# EAGLE design tdoa_4011_decotec (EAGLE 8.2.2)
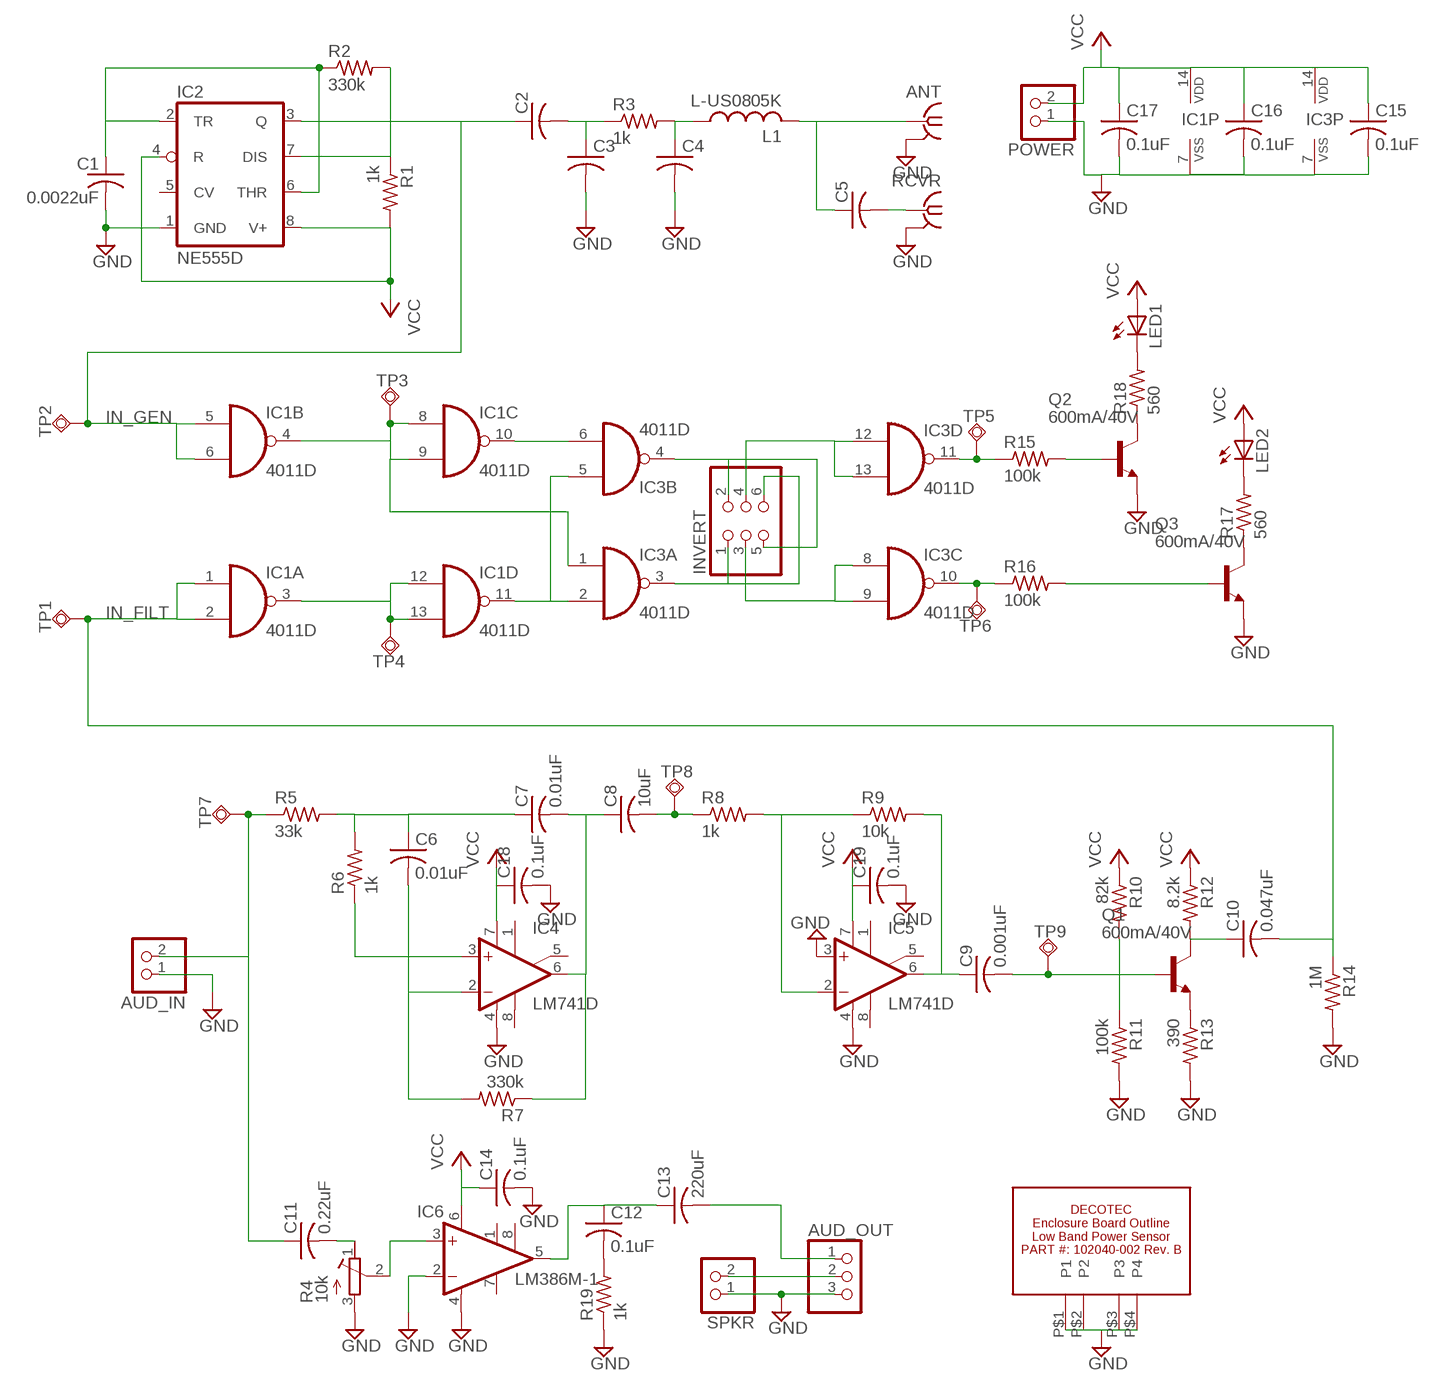
[diagram p0: schematic, sheet 1]

## Parts
ANT  SMA-142-0701-801/806  [J502-ND-142-0701-801/806]
AUD_IN  PINHD-1X2  [1X02]
AUD_OUT  PINHD-1X3  [1X03]
C1  0.0022uF  C-USC0805K  [C0805K]
C2  C-USC0805K  [C0805K]
C3  C-USC0805K  [C0805K]
C4  C-USC0805K  [C0805K]
C5  C-USC0805K  [C0805K]
C6  0.01uF  C-USC0805K  [C0805K]
C7  0.01uF  C-USC0805K  [C0805K]
C8  10uF  C-USC0805K  [C0805K]
C9  0.001uF  C-USC0805K  [C0805K]
C10  0.047uF  C-USC0805K  [C0805K]
C11  0.22uF  C-USC0805K  [C0805K]
C12  0.1uF  C-USC0805K  [C0805K]
C13  220uF  C-USC0805K  [C0805K]
C14  0.1uF  C-USC0805K  [C0805K]
C15  0.1uF  C-USC0805K  [C0805K]
C16  0.1uF  C-USC0805K  [C0805K]
C17  0.1uF  C-USC0805K  [C0805K]
C18  0.1uF  C-USC0805K  [C0805K]
C19  0.1uF  C-USC0805K  [C0805K]
IC1  4011D  [SO14]
IC2  NE555D  [SO08]
IC3  4011D  [SO14]
IC4  LM741D  [SO08]
IC5  LM741D  [SO08]
IC6  LM386M-1  [SO08]
INVERT  PINHD-2X3  [2X03]
L1  L-US0805K  [C0805K]
LED1  LED3MM  [LED3MM]
LED2  LED3MM  [LED3MM]
POWER  PINHD-1X2  [1X02]
Q1  600mA/40V  MMBT3904LT1-NPN-SOT23-BEC  [SOT23-BEC]
Q2  600mA/40V  MMBT3904LT1-NPN-SOT23-BEC  [SOT23-BEC]
Q3  600mA/40V  MMBT3904LT1-NPN-SOT23-BEC  [SOT23-BEC]
R1  1k  R-US_R0805  [R0805]
R2  330k  R-US_R0805  [R0805]
R3  1k  R-US_R0805  [R0805]
R4  10k  R-TRIMM3314G  [RTRIM3314G]
R5  33k  R-US_R0805  [R0805]
R6  1k  R-US_R0805  [R0805]
R7  330k  R-US_R0805  [R0805]
R8  1k  R-US_R0805  [R0805]
R9  10k  R-US_R0805  [R0805]
R10  82k  R-US_R0805  [R0805]
R11  100k  R-US_R0805  [R0805]
R12  8.2k  R-US_R0805  [R0805]
R13  390  R-US_R0805  [R0805]
R14  1M  R-US_R0805  [R0805]
R15  100k  R-US_R0805  [R0805]
R16  100k  R-US_R0805  [R0805]
R17  560  R-US_R0805  [R0805]
R18  560  R-US_R0805  [R0805]
R19  1k  R-US_R0805  [R0805]
RCVR  SMA-142-0701-801/806  [J502-ND-142-0701-801/806]
SPKR  PINHD-1X2  [1X02]
TP1  TPSQTP20SQ  [TP20SQ]
TP2  TPSQTP20SQ  [TP20SQ]
TP3  TPSQTP20SQ  [TP20SQ]
TP4  TPSQTP20SQ  [TP20SQ]
TP5  TPSQTP20SQ  [TP20SQ]
TP6  TPSQTP20SQ  [TP20SQ]
TP7  TPSQTP20SQ  [TP20SQ]
TP8  TPSQTP20SQ  [TP20SQ]
TP9  TPSQTP20SQ  [TP20SQ]
U$1  DECOTEC_102040-002B  [DECOTEC_102040-002B]

## Nets
AUDIO_IN: AUD_IN.2 C11.1 R5.1 TP7.TP
GND: ANT.G@1 ANT.G@2 ANT.G@3 ANT.G@4 AUD_IN.1 AUD_OUT.3 C1.2 C3.2 C4.2 C14.2 C15.2 C16.2 C17.2 C18.2 C19.2 IC1.7(P:VSS) IC2.1(GND) IC3.7(P:VSS) IC4.4(V-) IC5.3(+IN) IC5.4(V-) IC6.2(-IN) IC6.4(GND) POWER.1 Q2.E Q3.E R4.3(A) R11.2 R13.2 R14.2 R19.1 RCVR.G@1 RCVR.G@2 RCVR.G@3 RCVR.G@4 SPKR.1 U$1.P$1(P1) U$1.P$2(P2) U$1.P$3(P3) U$1.P$4(P4)
IN_FILT: C10.2 IC1.1(A:I0) IC1.2(A:I1) R14.1 TP1.TP
IN_GEN: C2.1 IC1.5(B:I0) IC1.6(B:I1) IC2.3(Q) TP2.TP
N$1: IC1.4(B:O) IC1.8(C:I0) IC1.9(C:I1) IC3.1(A:I0) TP3.TP
N$2: IC2.7(DIS) R1.1 R2.2
N$3: C1.1 IC2.2(TR) IC2.6(THR) R2.1
N$4: C2.2 C3.1 R3.1
N$5: C4.1 L1.1 R3.2
N$6: AUD_OUT.1 C13.2
N$7: C5.2 RCVR.1
N$8: ANT.1 C5.1 L1.2
N$10: C6.1 C7.1 R5.2 R6.2
N$11: IC4.3(+IN) R6.1
N$12: C6.2 IC4.2(-IN) R7.2
N$13: C7.2 C8.1 IC4.6(OUT) R7.1
N$14: C8.2 R8.1 TP8.TP
N$15: IC5.2(-IN) R8.2 R9.1
N$16: C9.1 IC5.6(OUT) R9.2
N$17: C9.2 Q1.B R10.2 R11.1 TP9.TP
N$18: Q1.E R13.1
N$19: C10.1 Q1.C R12.2
N$20: IC1.3(A:O) IC1.12(D:I0) IC1.13(D:I1) TP4.TP
N$21: IC1.11(D:O) IC3.2(A:I1) IC3.5(B:I0)
N$22: IC3.4(B:O) INVERT.2 INVERT.5
N$23: IC1.10(C:O) IC3.6(B:I1)
N$24: IC3.3(A:O) INVERT.1 INVERT.6
N$25: IC3.12(D:I0) IC3.13(D:I1) INVERT.4
N$26: IC3.8(C:I0) IC3.9(C:I1) INVERT.3
N$27: Q2.C R18.1
N$28: LED1.K(C) R18.2
N$29: Q3.C R17.1
N$30: LED2.K(C) R17.2
N$31: IC3.11(D:O) R15.1 TP5.TP
N$32: Q2.B R15.2
N$33: IC3.10(C:O) R16.1 TP6.TP
N$34: Q3.B R16.2
N$35: IC6.3(+IN) R4.2(S)
N$36: C11.2 R4.1(E)
N$37: C12.1 C13.1 IC6.5(OUT)
N$38: C12.2 R19.2
SPKR+: AUD_OUT.2 SPKR.2
VCC: C14.1 C15.1 C16.1 C17.1 C18.1 C19.1 IC1.14(P:VDD) IC2.4(R) IC2.8(V+) IC3.14(P:VDD) IC4.7(V+) IC5.7(V+) IC6.6(VS) LED1.A LED2.A POWER.2 R1.2 R10.1 R12.1
Unconnected: IC2.5(CV) IC4.1(ON1) IC4.5(ON2) IC4.8(OPT) IC5.1(ON1) IC5.5(ON2) IC5.8(OPT) IC6.1(GAIN) IC6.7(BYPASS) IC6.8(GAIN)

## Library data of the parts
ANT RCVR = con-coax:SMA-: SMA 50 Ohm End Launch Jack Receptacle - Round Contact Johnson Components Source: www.johnsoncomponents.com .. J502-ND.pdf; MF: JOHNSON COMPONENTS; MPN: 142-0701-801; OC_FARNELL: 1608592; OC_NEWARK: 90F2624
AUD_IN POWER SPKR = pinhead:PINHD-1X2: PIN HEADER
AUD_OUT = pinhead:PINHD-1X3: PIN HEADER
C1-C19 = rcl:C-US: CAPACITOR, American symbol
IC1 IC3 = 40xx:4011: Quad 2-input NAND
IC2 = linear:*555: TIMER
IC4 IC5 = linear:*741: OP AMP
IC6 = linear:LM386?-*: Low Voltage Audio Power Amplifier Source: http://cache.national.com/ds/LM/LM386.pdf
INVERT = pinhead:PINHD-2X3: PIN HEADER
L1 = kj4qlp:L-US0805K
LED1 LED2 = adafruit:LED: LED OSRAM: - CHIPLED LG R971, LG N971, LY N971, LG Q971, LY Q971, LO R971, LY R971 LH N974, LH R974 LS Q976, LO Q976, LY Q976 LO Q996 - Hyper CHIPLED LW Q18S LB Q993, LB Q99A, LB R99A - SideLED LS A670, LO A670, LY A670, LG A670, LP A670 LB A673, LV A673, LT A673, LW A673 LH A674 LY A675 LS A676, LA A676, LO A676, LY A676, LW A676 LS A679, LY A679, LG A679 - Hyper Micro SIDELED® LS Y876, LA Y876, LO Y876, LY Y876 LT Y87S - SmartLED LW L88C, LW L88S LB L89C, LB L89S, LG L890 LS L89K, LO L89K, LY L89K LS L896, LA L896, LO L896, LY L896 - TOPLED LS T670, LO T670, LY T670, LG T670, LP T670 LSG T670, LSP T670, LSY T670, LOP T670, LYG T670 LG T671, LOG T671, LSG T671 LB T673, LV T673, LT T673, LW T673 LH T674 LS T676, LA T676, LO T676, LY T676, LB T676, LH T676, LSB T676, LW T676 LB T67C, LV T67C, LT T67C, LS T67K, LO T67K, LY T67K, LW E67C LS E67B, LA E67B, LO E67B, LY E67B, LB E67C, LV E67C, LT E67C LW T67C LS T679, LY T679, LG T679 LS T770, LO T770, LY T770, LG T770, LP T770 LB T773, LV T773, LT T773, LW T773 LH T774 LS E675, LA E675, LY E675, LS T675 LS T776, LA T776, LO T776, LY T776, LB T776 LHGB T686 LT T68C, LB T68C - Hyper Mini TOPLED® LB M676 - Mini TOPLED Santana® LG M470 LS M47K, LO M47K, LY M47K Source: http://www.osram.convergy.de/
Q1-Q3 = transistor:*-NPN-: NPN Transistror BF959 corrected 2008.03.06
R1-R3 R5-R19 = rcl:R-US_: RESISTOR, American symbol
R4 = rcl:R-TRIMM: Trimm resistor
TP1-TP9 = testpad:TPSQ: Test pad
U$1 = vtgs:DECOTEC_102040-002B

## Board
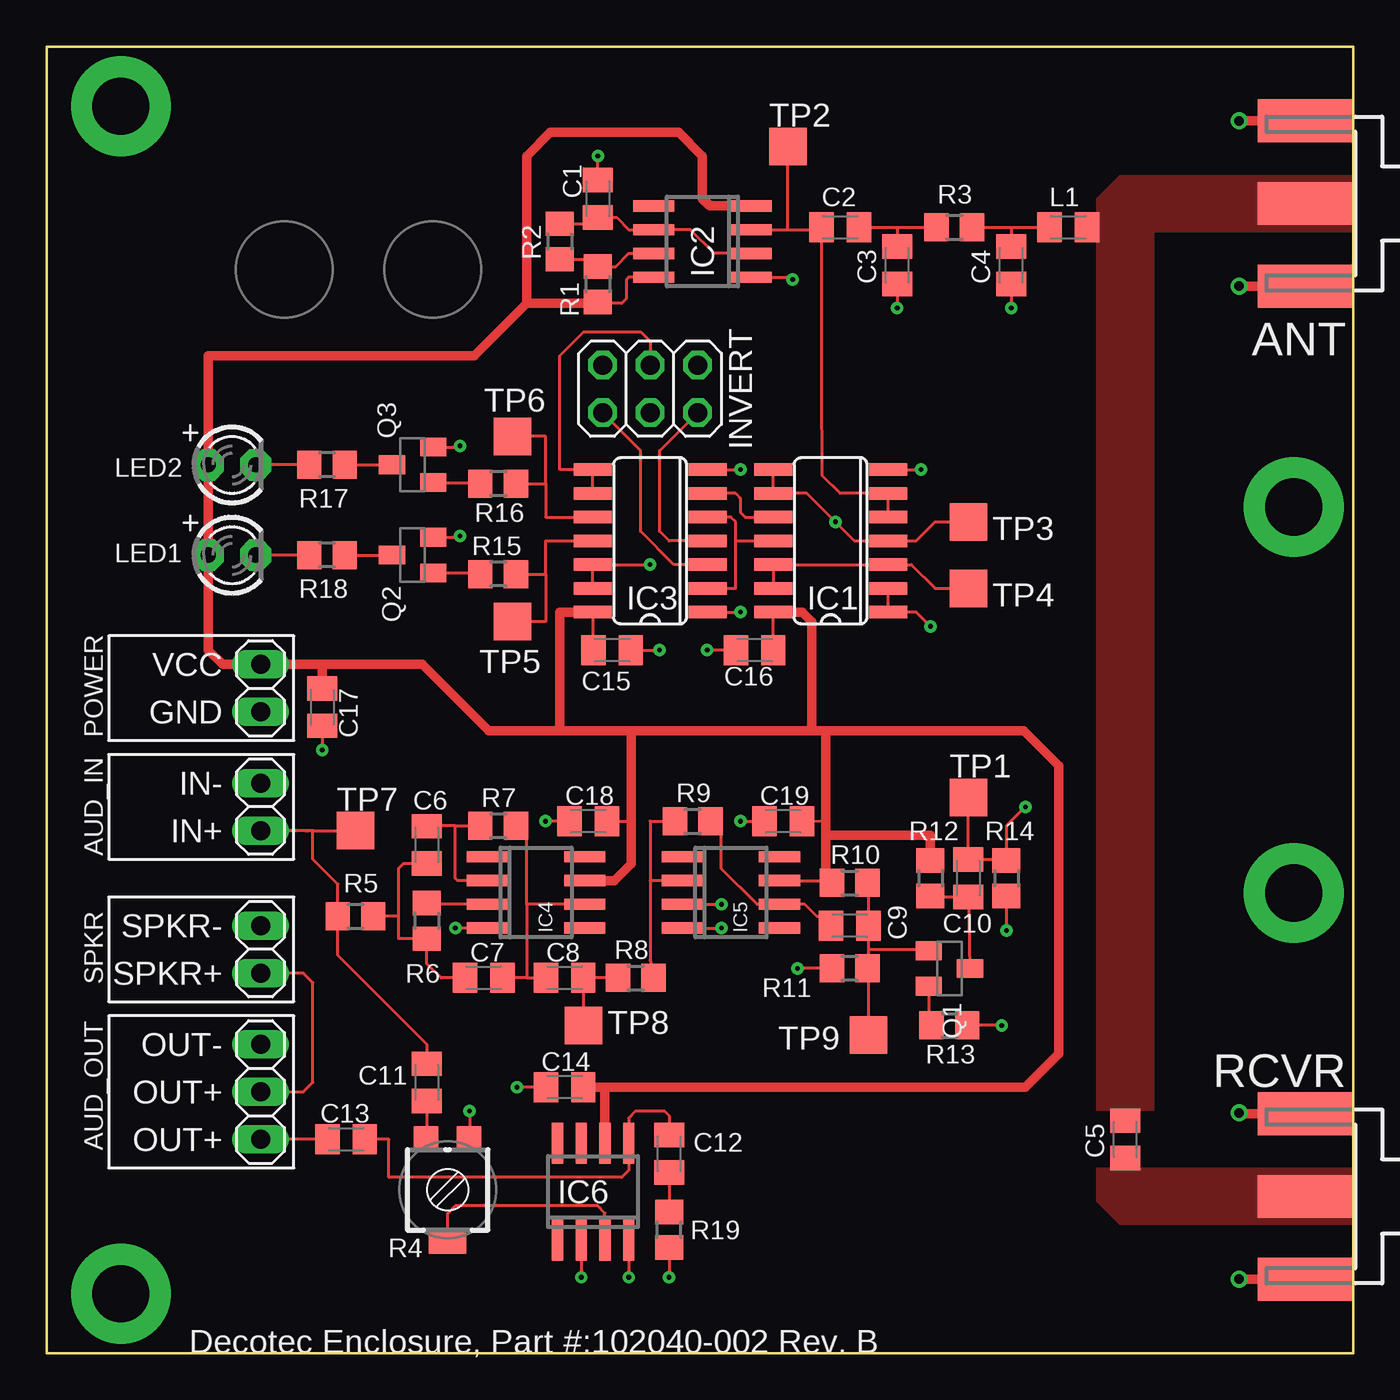
[diagram p1: board, top side]
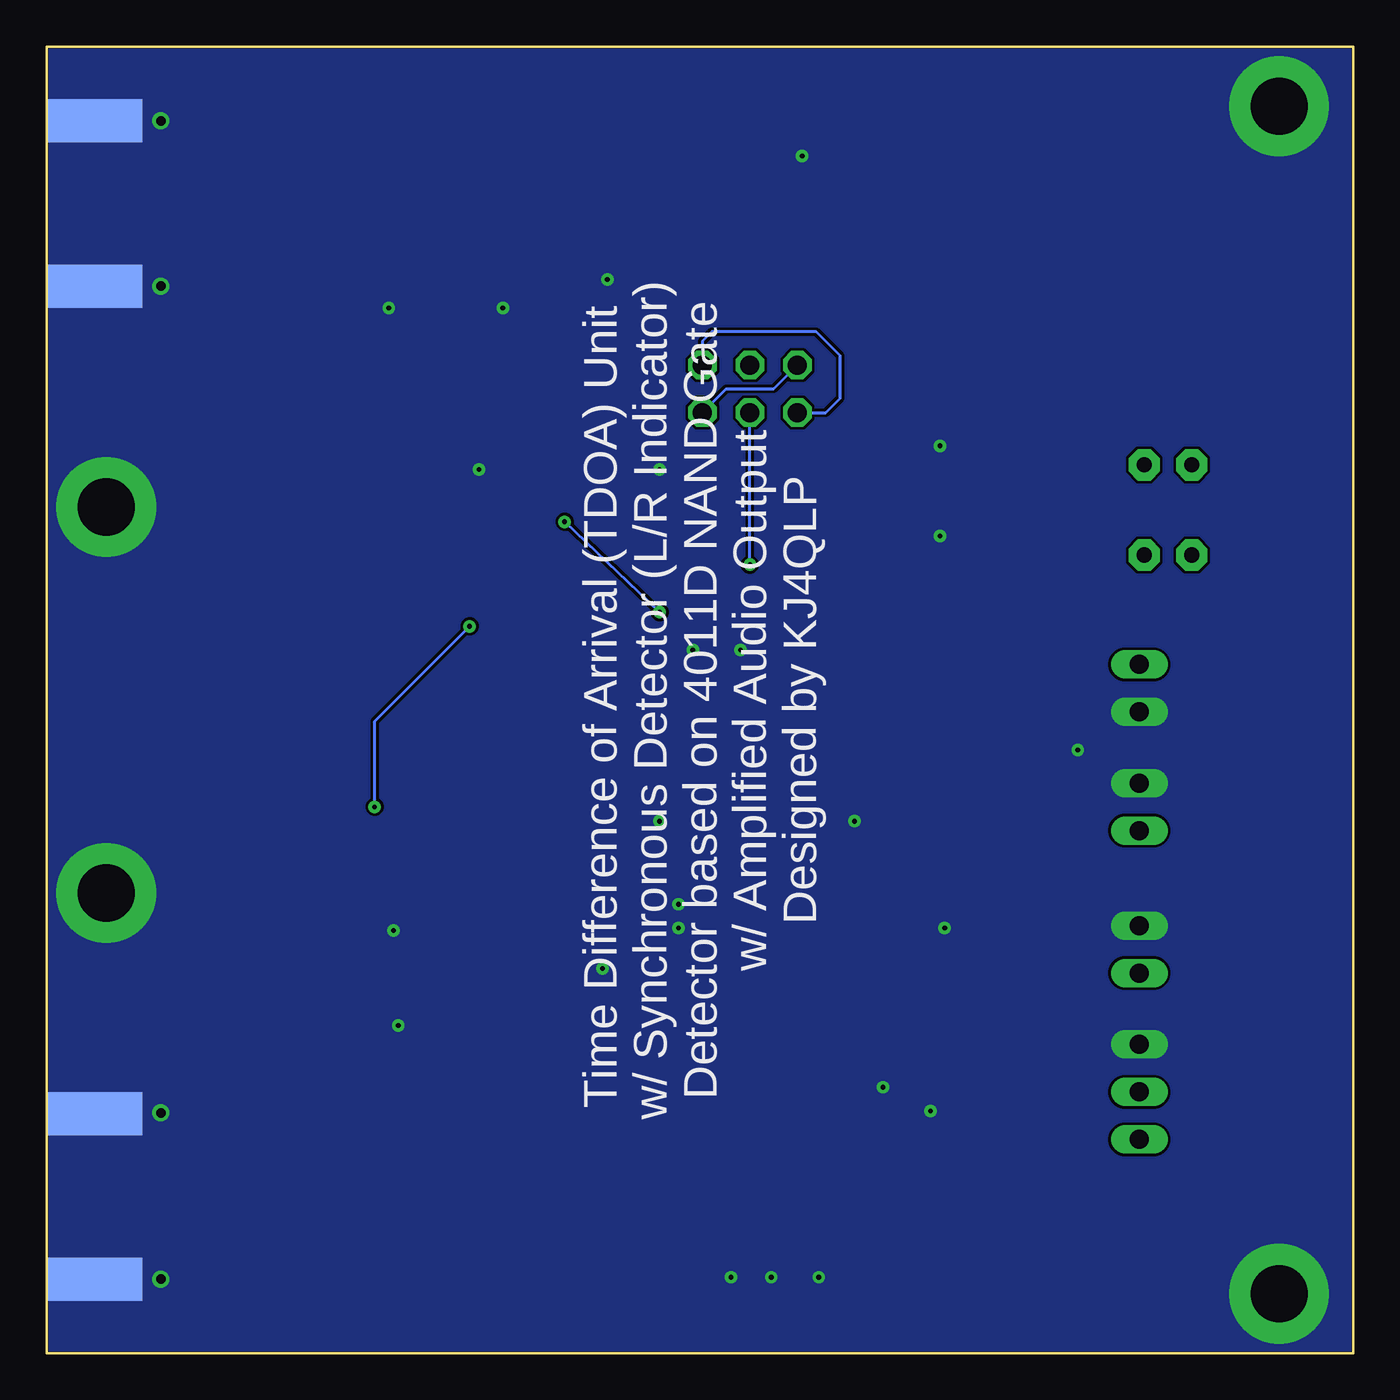
[diagram p2: board, bottom side, seen from below]

Size 69.85 x 69.85 mm. Coordinates in mm from the lower left corner, seen from the top.
Copper layers (1*16): Top 0.035mm / dielectric 1.5mm / Bottom 0.035mm
Design rules "default *": minimum track width 6mil, minimum drill 10mil, track to track 6mil, track to pad 6mil, pad to pad 6mil, via to via 6mil, smd to smd 6mil, copper to edge 1mil, drill to drill 6mil, minimum pad ring 10mil, minimum via ring 8mil, stop-mask expansion 4mil, vias tented up to drill 0mil, thermal gap 10mil

### Footprints (pad centres in the part's own frame; a part is rotated, then mirrored left to right if it is on the bottom)
J502-ND-142-0701-801/806 = smd 5.08 x 2.286: 1 2.565,0; G@1 2.565,4.42; G@2 2.565,-4.42 | smd 5.08 x 2.286 bottom: G@3 2.565,4.42; G@4 2.565,-4.42
1X02 = drill 1.016 long: 1 -1.27,0; 2 1.27,0
1X03 = drill 1.016 long: 1 -2.54,0; 2 0,0; 3 2.54,0
C0805K = smd 1.3 x 1.6: 1 -1,0; 2 1,0
SO14 = smd 0.66 x 2.032: 1 -3.81,-3.073; 2 -2.54,-3.073; 3 -1.27,-3.073; 4 0,-3.073; 5 1.27,-3.073; 6 2.54,-3.073; 7 3.81,-3.073; 8 3.81,3.073; 9 2.54,3.073; 10 1.27,3.073; 11 0,3.073; 12 -1.27,3.073; 13 -2.54,3.073; 14 -3.81,3.073
SO08 = smd 0.6 x 2.2: 1 -1.905,-2.6; 2 -0.635,-2.6; 3 0.635,-2.6; 4 1.905,-2.6; 5 1.905,2.6; 6 0.635,2.6; 7 -0.635,2.6; 8 -1.905,2.6
2X03 = drill 1.016 octagon: 1 -2.54,-1.27; 2 -2.54,1.27; 3 0,-1.27; 4 0,1.27; 5 2.54,-1.27; 6 2.54,1.27
LED3MM = drill 0.813 pad 1.676 octagon: A -1.27,0; K 1.27,0
SOT23-BEC = smd 1 x 1.4: B -0.95,-1.1; C 0,1.1; E 0.95,-1.1
R0805 = smd 1.3 x 1.5: 1 -0.95,0; 2 0.95,0
RTRIM3314G = smd 1.3 x 1.3: 1 1.15,-2.75; 3 -1.15,-2.75 | smd 2 x 1.3: 2 0,2.75
TP20SQ = smd 2 x 2: TP 0,0
DECOTEC_102040-002B = drill 3.048 pad 5.334: P$1 3.969,3.175; P$2 3.969,66.675; P$3 66.675,45.244; P$4 66.675,24.606

### Placement (x,y rotation side)
ANT  69.85,61.47 180 top
AUD_IN  11.43,29.21 270 top
AUD_OUT  11.43,13.97 90 top
C1  29.46,61.72 90 top
C2  42.42,60.2 0 top
C3  45.47,58.17 270 top
C4  51.56,58.17 270 top
C5  57.66,11.43 270 top
C6  20.32,27.18 90 top
C7  23.37,20.07 0 top
C8  27.69,20.07 0 top
C9  42.93,22.86 0 top
C10  49.28,25.4 90 top
C11  20.32,14.48 270 top
C12  33.27,10.67 270 top
C13  16,11.43 180 top
C14  27.69,14.22 180 top
C15  30.23,37.59 0 top
C16  37.85,37.59 180 top
C17  14.73,34.54 270 top
C18  28.96,28.45 180 top
C19  39.37,28.45 180 top
IC1  41.91,43.43 90 top
IC2  35.05,59.44 90 top
IC3  32.26,43.43 90 top
IC4  26.16,24.64 270 top
IC5  36.58,24.64 270 top
IC6  29.21,8.64 0 top
INVERT  32.26,51.56 180 top
L1  54.61,60.2 0 top
LED1  9.91,42.67 0 top
LED2  9.91,47.5 0 top
POWER  11.43,35.56 90 top
Q1  48.26,20.57 270 top
Q2  19.56,42.67 90 top
Q3  19.56,47.5 90 top
R1  29.46,57.15 270 top
R2  27.43,59.44 270 top
R3  48.51,60.2 0 top
R4  21.43,8.73 180 top
R5  16.51,23.37 0 top
R6  20.32,23.11 270 top
R7  24.13,28.19 180 top
R8  31.5,20.07 0 top
R9  34.54,28.45 0 top
R10  42.93,25.15 0 top
R11  42.93,20.57 180 top
R12  47.24,25.4 270 top
R13  48.26,17.53 0 top
R14  51.31,25.4 270 top
R15  24.13,41.66 180 top
R16  24.13,46.48 180 top
R17  14.99,47.5 180 top
R18  14.99,42.67 180 top
R19  33.27,6.6 90 top
RCVR  69.85,8.38 180 top
SPKR  11.43,21.59 270 top
TP1  49.28,29.72 0 top
TP2  39.62,64.52 0 top
TP3  49.28,44.45 0 top
TP4  49.28,40.89 0 top
TP5  24.89,39.12 180 top
TP6  24.89,49.02 0 top
TP7  16.51,27.94 0 top
TP8  28.7,17.53 0 top
TP9  43.94,17.02 90 top
U$1  0,0 0 top

### Tracks (layer width: path | path; a pad name or v marks a point on that pad's centre or on a via)
AUDIO_IN
  Top 0.152: 13.82,27.94 13.97,27.94 | 13.82,27.94 AUD_IN.2 | C11.1 20.32,16.51 15.56,21.27 R5.1 15.56,25.08 14.22,26.42 14.22,27.89 14.27,27.94 | 14.27,27.94 TP7.TP | 14.27,27.94 13.82,27.94
GND  (via drill 0.25, 0.51)
  Top 0.152: IC5.3 v36.07,24 | IC4.4 v21.84,22.73 | R14.2 v51.31,22.61 | C3.2 v45.47,55.88 | C4.2 v51.56,55.88 | IC2.1 39.75,57.53 v39.88,57.4 | C1.2 v29.46,64.01 | Q3.E 22.03,48.45 v22.1,48.51 | Q2.E 21.78,43.62 v22.1,43.69 | v22.61,12.95 22.61,11.51 R4.3 | C14.2 v25.15,14.22 | R19.1 v33.27,4.06 | IC6.4 v31.11,4.06 | IC6.2 v28.57,4.06 | IC1.7 v46.74,47.24 | IC3.7 v37.08,47.24 | C18.2 v26.67,28.45 | v37.08,28.45 C19.2 | C16.2 v35.31,37.59 | C17.2 v14.73,32.26 | IC5.4 v36.07,22.73 | R11.2 v40.13,20.57 | v51.05,17.53 R13.2 | C15.2 v32.77,37.59
  Top 0.508: ANT.G@4 v63.75,65.89 | ANT.G@3 v63.75,57.05 | RCVR.G@3 v63.75,3.96 | RCVR.G@4 63.8,12.8 v63.75,12.85
  pour Bottom (no thermals): 0,69.85 69.85,69.85 69.85,0 0,0
IN_FILT  (via drill 0.25)
  Top 0.152: 49.4,26.4 C10.2 | 49.4,26.4 51.26,26.4 R14.1 51.31,28.19 v52.32,29.21 | IC1.1 IC1.2 | TP1.TP 49.28,26.53 49.4,26.4 | v47.24,38.86 46.48,39.62 IC1.1 | 44.96,39.6 IC1.1
  Bottom 0.152: v52.32,29.21 52.32,32.77 52.32,33.78 v47.24,38.86
IN_GEN
  Top 0.152: IC1.5 IC1.6 42.42,45.97 41.45,46.95 41.42,51.8 C2.1 41.29,60.07 39.62,60.07 | IC2.3 39.62,60.07 | 39.62,60.07 TP2.TP
N$1  (via drill 0.25)
  Top 0.152: 38.84,46.03 IC1.9 | 38.84,46.03 IC1.8 | 38.84,46.03 38.89,45.97 40.64,45.97 v42.16,44.45 43.18,43.43 IC1.4 46.48,43.43 47.5,44.45 TP3.TP | IC3.1 v37.08,39.62
  Bottom 0.152: v37.08,39.62 v42.16,44.45
N$2
  Top 0.152: IC2.7 31.11,58.8 30.41,58.1 R1.1 29.08,58.49 R2.2
N$3
  Top 0.152: R2.1 29.13,60.39 C1.1 30.46,60.72 31.11,60.07 IC2.6 34.42,60.07 35.69,58.8 IC2.2
N$4
  Top 0.152: C2.2 45.47,60.2 | 45.47,60.2 R3.1 | 45.47,60.2 C3.1
N$5
  Top 0.152: R3.2 51.56,60.2 | 51.56,60.2 L1.1 | 51.56,60.2 C4.1
N$6
  Top 0.152: C13.2 AUD_OUT.1
N$7
  pour Top (no thermals): 56.13,9.91 69.85,9.91 69.85,6.86 57.4,6.86 56.13,8.13
N$8
  pour Top (no thermals): 56.13,12.95 56.13,61.72 57.4,62.99 59.18,62.99 59.18,12.95
  pour Top (no thermals): 56.13,61.72 57.4,62.99 69.85,62.99 69.85,59.94 56.13,59.94
N$10
  Top 0.152: 18.77,23.37 R5.2 | 18.77,23.37 18.8,23.37 18.8,22.16 R6.2 20.32,20.83 21.08,20.07 C7.1 | C6.1 19.07,26.18 18.8,25.91 18.8,23.39 18.77,23.37
N$11
  Top 0.152: IC4.3 20.32,24 R6.1
N$12
  Top 0.152: 21.85,28.19 R7.2 | 21.85,28.19 20.34,28.19 C6.2 | IC4.2 21.97,25.27 21.84,25.4 21.84,28.19 21.85,28.19
N$13
  Top 0.152: 25.66,20.07 C7.2 | 25.66,20.07 C8.1 | R7.1 25.15,28.19 25.65,27.69 25.65,23.98 | 25.65,23.98 25.65,20.08 25.66,20.07 | IC4.6 25.68,24 25.65,23.98
N$14
  Top 0.152: R8.1 C8.2 28.69,17.8 TP8.TP
N$15
  Top 0.152: 32.26,25.27 32.26,28.45 R9.1 | IC5.2 32.26,25.27 | 32.26,25.27 32.26,21.02 R8.2
N$16
  Top 0.152: C9.1 41.91,23.37 41.16,23.37 40.53,24 IC5.6 37.97,24 36.07,25.91 36.07,27.87 R9.2
N$17
  Top 0.152: R10.2 43.93,25.1 C9.2 43.93,21.59 | 43.93,21.59 43.93,20.62 R11.1 43.94,20.51 TP9.TP | 43.93,21.59 47.09,21.59 Q1.B
N$18
  Top 0.152: Q1.E 47.16,17.68 R13.1
N$19
  Top 0.152: R12.2 47.29,24.4 C10.1 Q1.C
N$20
  Top 0.152: IC1.13 IC1.12 IC1.3 46.23,42.16 47.5,40.89 TP4.TP
N$21
  Top 0.152: 36.83,43.43 IC1.11 | 36.83,43.43 36.83,44.45 36.58,44.7 IC3.5 | IC3.2 36.83,40.89 36.83,43.43
N$22
  Top 0.152: IC3.4 33.27,43.43 32.77,43.94 32.77,48.26 INVERT.2
  Bottom 0.152: INVERT.2 33.53,51.56 30.99,51.56 INVERT.5
N$23
  Top 0.152: IC3.6 36.83,45.97 37.08,45.72 37.08,44.96 37.34,44.7 IC1.10
N$24
  Top 0.152: IC3.3 33.53,42.16 31.75,43.94 31.75,48.26 INVERT.6
  Bottom 0.152: INVERT.6 28.19,50.29 27.43,51.05 27.43,53.34 28.7,54.61 34.29,54.61 34.8,54.1 INVERT.1
N$25  (via drill 0.25)
  Top 0.152: IC3.13 IC3.12 v32.26,42.16
  Bottom 0.152: v32.26,42.16 INVERT.4
N$26
  Top 0.152: IC3.9 IC3.8 27.43,47.24 27.43,53.34 28.7,54.61 31.75,54.61 32.26,54.1 INVERT.3
N$27
  Top 0.152: R18.1 Q2.C
N$28
  Top 0.152: R18.2 LED1.K
N$29
  Top 0.152: R17.1 Q3.C
N$30
  Top 0.152: R17.2 LED2.K
N$31
  Top 0.152: IC3.11 26.67,43.43 26.67,41.66 | R15.1 26.67,41.66 | 26.67,41.66 26.67,39.12 TP5.TP
N$32
  Top 0.152: Q2.B 23.11,41.72 R15.2
N$33
  Top 0.152: IC3.10 26.67,44.7 26.67,46.48 | R16.1 26.67,46.48 | 26.67,46.48 26.67,49.02 TP6.TP
N$34
  Top 0.152: Q3.B 23.11,46.55 R16.2
N$35
  Top 0.152: R4.2 21.43,7.46 21.84,7.87 29.46,7.87 29.84,7.49 IC6.3
N$36
  Top 0.152: C11.2 20.32,11.52 R4.1
N$37
  Top 0.152: C12.1 33.27,12.7 33.02,12.95 31.5,12.95 31.11,12.57 IC6.5 31.11,9.78 30.73,9.4 18.29,9.4 18.29,11.43 C13.1
N$38
  Top 0.152: C12.2 R19.2
SPKR+
  Top 0.152: AUD_OUT.2 13.72,13.97 14.22,14.48 14.22,19.81 13.72,20.32 SPKR.2
VCC
  Top 0.152: IC2.8 31.11,57.53 30.99,57.4 30.99,56.39 30.73,56.13 29.53,56.13 R1.2 | C19.1 41.65,28.46 41.66,28.2 | C16.1 IC1.14 | C15.1 29.21,37.59 29.21,39.59 29.19,39.61 27.43,39.62 | C18.1 31.2,28.45 31.24,28.4 | IC5.7 41.78,25.27 41.91,25.15 R10.1
  Top 0.508: 25.65,56.13 22.86,53.34 8.64,53.34 LED2.A LED1.A 8.64,37.59 9.4,36.83 POWER.2 14.74,36.83 | 25.65,56.13 29.4,56.13 R1.2 | IC2.4 35.43,61.34 35.05,61.72 35.05,64.01 33.78,65.28 26.92,65.28 25.65,64.01 25.65,56.13 | R12.1 47.24,27.69 41.66,27.69 | 31.24,33.27 40.89,33.27 | 27.43,33.27 27.43,39.62 IC3.14 | IC4.7 30.35,25.27 31.24,26.16 31.24,28.4 31.24,33.27 | 41.66,33.27 41.66,28.2 41.66,27.69 | 41.66,33.27 40.89,33.27 | 31.24,33.27 27.43,33.27 | 29.9,14.22 C14.1 | 29.9,14.22 52.32,14.22 54.1,16 54.1,31.41 52.23,33.27 41.66,33.27 | IC1.14 40.39,39.62 40.89,39.12 40.89,33.27 | IC6.6 29.84,14.17 29.9,14.22 | 41.66,27.69 41.66,25.47 R10.1 | 14.74,36.83 20.07,36.83 23.62,33.27 27.43,33.27 | C17.1 14.73,36.82 14.74,36.83

### Text on the board
bPlace: Time Difference of Arrival (TDOA) Unit / w/ Synchronous Detector (L/R Indicator) / Detector based on 4011D NAND Gate / w/ Amplified Audio Output / Designed by KJ4QLP
tNames: VCC | GND | IN- | IN+ | SPKR- | SPKR+ | OUT- | OUT+ | OUT+